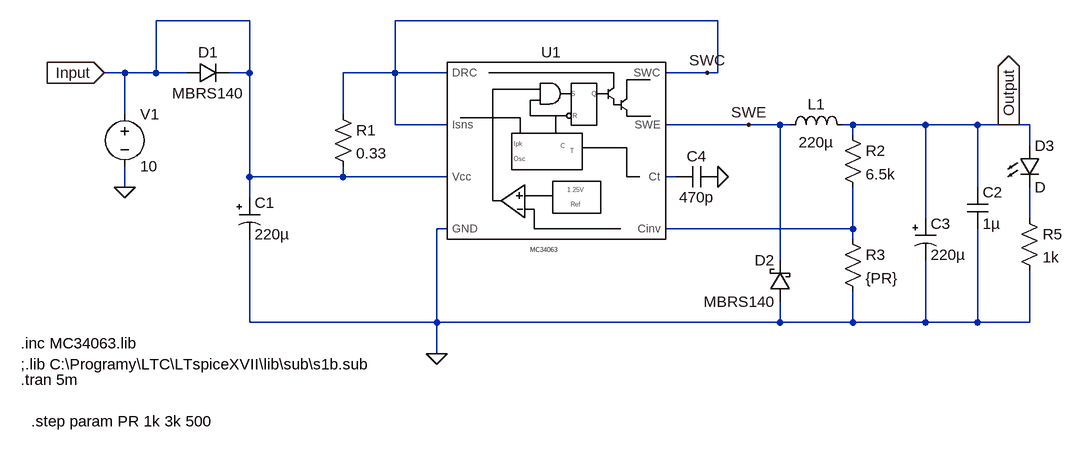
[diagram p0: schematic 5_Step_Down_PSU.asc]
5_Step_Down_PSU.asc, the LTspice schematic file:
Version 4
SHEET 1 1144 680
WIRE -304 -96 -448 -96
WIRE 416 -96 -80 -96
WIRE -496 -16 -528 -16
WIRE -448 -16 -448 -96
WIRE -448 -16 -496 -16
WIRE -400 -16 -448 -16
WIRE -304 -16 -304 -96
WIRE -304 -16 -336 -16
WIRE -80 -16 -80 -96
WIRE -80 -16 -160 -16
WIRE 0 -16 -80 -16
WIRE 400 -16 336 -16
WIRE 416 -16 416 -96
WIRE 416 -16 400 -16
WIRE -496 48 -496 -16
WIRE -160 48 -160 -16
WIRE -80 64 -80 -16
WIRE 0 64 -80 64
WIRE 464 64 336 64
WIRE 512 64 464 64
WIRE 528 64 512 64
WIRE 624 64 608 64
WIRE 736 64 624 64
WIRE 816 64 736 64
WIRE 864 64 816 64
WIRE 896 64 864 64
WIRE 624 80 624 64
WIRE 896 96 896 64
WIRE -304 144 -304 -16
WIRE -160 144 -160 128
WIRE -160 144 -304 144
WIRE 0 144 -160 144
WIRE 352 144 336 144
WIRE -496 160 -496 128
WIRE 816 160 816 64
WIRE -304 176 -304 144
WIRE 736 208 736 64
WIRE 896 208 896 160
WIRE 0 224 -16 224
WIRE 624 224 624 160
WIRE 624 224 336 224
WIRE 624 240 624 224
WIRE 512 272 512 64
WIRE -304 368 -304 240
WIRE -16 368 -16 224
WIRE -16 368 -304 368
WIRE 512 368 512 336
WIRE 512 368 -16 368
WIRE 624 368 624 320
WIRE 624 368 512 368
WIRE 736 368 736 272
WIRE 736 368 624 368
WIRE 816 368 816 224
WIRE 816 368 736 368
WIRE 896 368 896 288
WIRE 896 368 816 368
WIRE -16 416 -16 368
FLAG -16 416 0
FLAG -528 -16 Input
IOPIN -528 -16 In
FLAG 864 64 Output
IOPIN 864 64 Out
FLAG -496 160 0
FLAG 416 144 0
FLAG 400 -16 SWC
FLAG 464 64 SWE
SYMBOL diode -400 0 R270
WINDOW 0 32 32 VTop 2
WINDOW 3 0 32 VBottom 2
SYMATTR InstName D1
SYMATTR Value MBRS140
SYMBOL res -176 32 R0
SYMATTR InstName R1
SYMATTR Value 0.33
SYMBOL res 608 64 R0
SYMATTR InstName R2
SYMATTR Value 6.5k
SYMATTR SpiceLine tol=1
SYMBOL res 608 224 R0
SYMATTR InstName R3
SYMATTR Value {PR}
SYMATTR SpiceLine tol=1
SYMBOL res 880 192 R0
SYMATTR InstName R5
SYMATTR Value 1k
SYMATTR SpiceLine tol=1
SYMBOL polcap -320 176 R0
WINDOW 3 24 56 Left 2
SYMATTR Value 220µ
SYMATTR InstName C1
SYMATTR Description Capacitor
SYMATTR Type cap
SYMATTR SpiceLine V=25 Irms=575m Rser=0.12 Lser=0 mfg="Panasonic" pn="ECA1EFQ221L" type="Al electrolytic"
SYMBOL cap 800 160 R0
SYMATTR InstName C2
SYMATTR Value 1µ
SYMATTR SpiceLine V=25
SYMBOL polcap 720 208 R0
WINDOW 3 24 56 Left 2
SYMATTR Value 220µ
SYMATTR InstName C3
SYMATTR Description Capacitor
SYMATTR Type cap
SYMATTR SpiceLine V=25 Irms=575m Rser=0.12 Lser=0
SYMBOL ind 512 80 R270
WINDOW 0 32 56 VTop 2
WINDOW 3 5 56 VBottom 2
SYMATTR InstName L1
SYMATTR Value 220µ
SYMATTR SpiceLine Ipk=1 Rser=0.366 Rpar=89931.3 Cpar=7.74133p mfg="Wurth Elektronik" pn="7447714221 WE-PD 1050"
SYMBOL cap 416 128 R90
WINDOW 0 0 32 VBottom 2
WINDOW 3 32 32 VTop 2
SYMATTR InstName C4
SYMATTR Value 470p
SYMBOL schottky 528 336 R180
WINDOW 0 24 64 Left 2
WINDOW 3 24 0 Left 2
SYMATTR InstName D2
SYMATTR Value MBRS140
SYMATTR Description Diode
SYMATTR Type diode
SYMBOL voltage -496 32 R0
WINDOW 123 0 0 Left 2
WINDOW 39 0 0 Left 2
SYMATTR InstName V1
SYMATTR Value 10
SYMBOL mc34063 240 80 R0
WINDOW 0 -95 -128 Left 2
SYMATTR InstName U1
SYMBOL LED 880 96 R0
SYMATTR InstName D3
TEXT -656 432 Left 2 !;.lib C:\\Programy\\LTC\\LTspiceXVII\\lib\\sub\\s1b.sub
TEXT -656 400 Left 2 !.inc MC34063.lib
TEXT -656 456 Left 2 !.tran 5m
TEXT -640 520 Left 2 !.step param PR 1k 3k 500

The netlist it stands for:
* 5_Step_Down_PSU.asc
D1 Input Input MBRS140
R1 SWC Input 0.33
R2 Output N003 6.5k tol=1
R3 N003 0 {PR} tol=1
R5 N002 0 1k tol=1
C1 Input 0 220µ V=25 Irms=575m Rser=0.12 Lser=0 mfg="Panasonic" pn="ECA1EFQ221L" type="Al electrolytic"
C2 Output 0 1µ V=25
C3 Output 0 220µ V=25 Irms=575m Rser=0.12 Lser=0
L1 SWE Output 220µ Ipk=1 Rser=0.366 Rpar=89931.3 Cpar=7.74133p mfg="Wurth Elektronik" pn="7447714221 WE-PD 1050"
C4 0 N001 470p
D2 0 SWE MBRS140
V1 Input 0 10
XU1 SWC SWE N001 0 N003 Input SWC SWC MC34063  ; pins SWC SWE Ct GND Cinv Vcc Isns DRC
D3 Output N002 D
.model D D
.lib standard.dio
;.lib C:\Programy\LTC\LTspiceXVII\lib\sub\s1b.sub
.inc MC34063.lib
.tran 5m
.step param PR 1k 3k 500
.backanno
.end